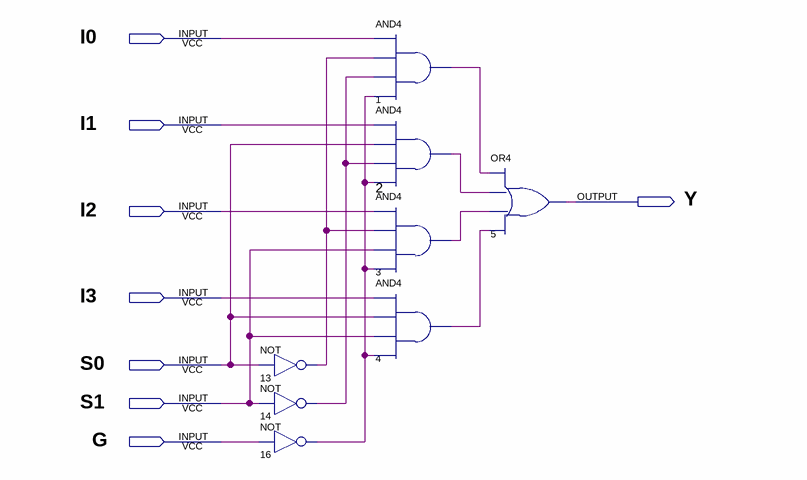
[diagram p0: schematic sheet]
// Quartus schematic 4x1_Mux_E.bdf as structural Verilog: 8 symbols, 8 pins
module \4x1_Mux_E  (
  input  I0,
  input  I1,
  input  I2,
  input  I3,
  input  S0,
  input  S1,
  input  G,
  output Y
);

  wire n1_out, n2_out, n3_out, n4_out, n13_out, n14_out, n16_out;

  not u_13 (n13_out, S0);
  not u_14 (n14_out, S1);
  not u_16 (n16_out, G);
  and u_1 (n1_out, I0, n13_out, n14_out, n16_out);
  and u_2 (n2_out, I1, S0, n14_out, n16_out);
  and u_3 (n3_out, I2, n13_out, S1, n16_out);
  and u_4 (n4_out, I3, S0, S1, n16_out);
  or u_5 (Y, n1_out, n2_out, n3_out, n4_out);
endmodule
